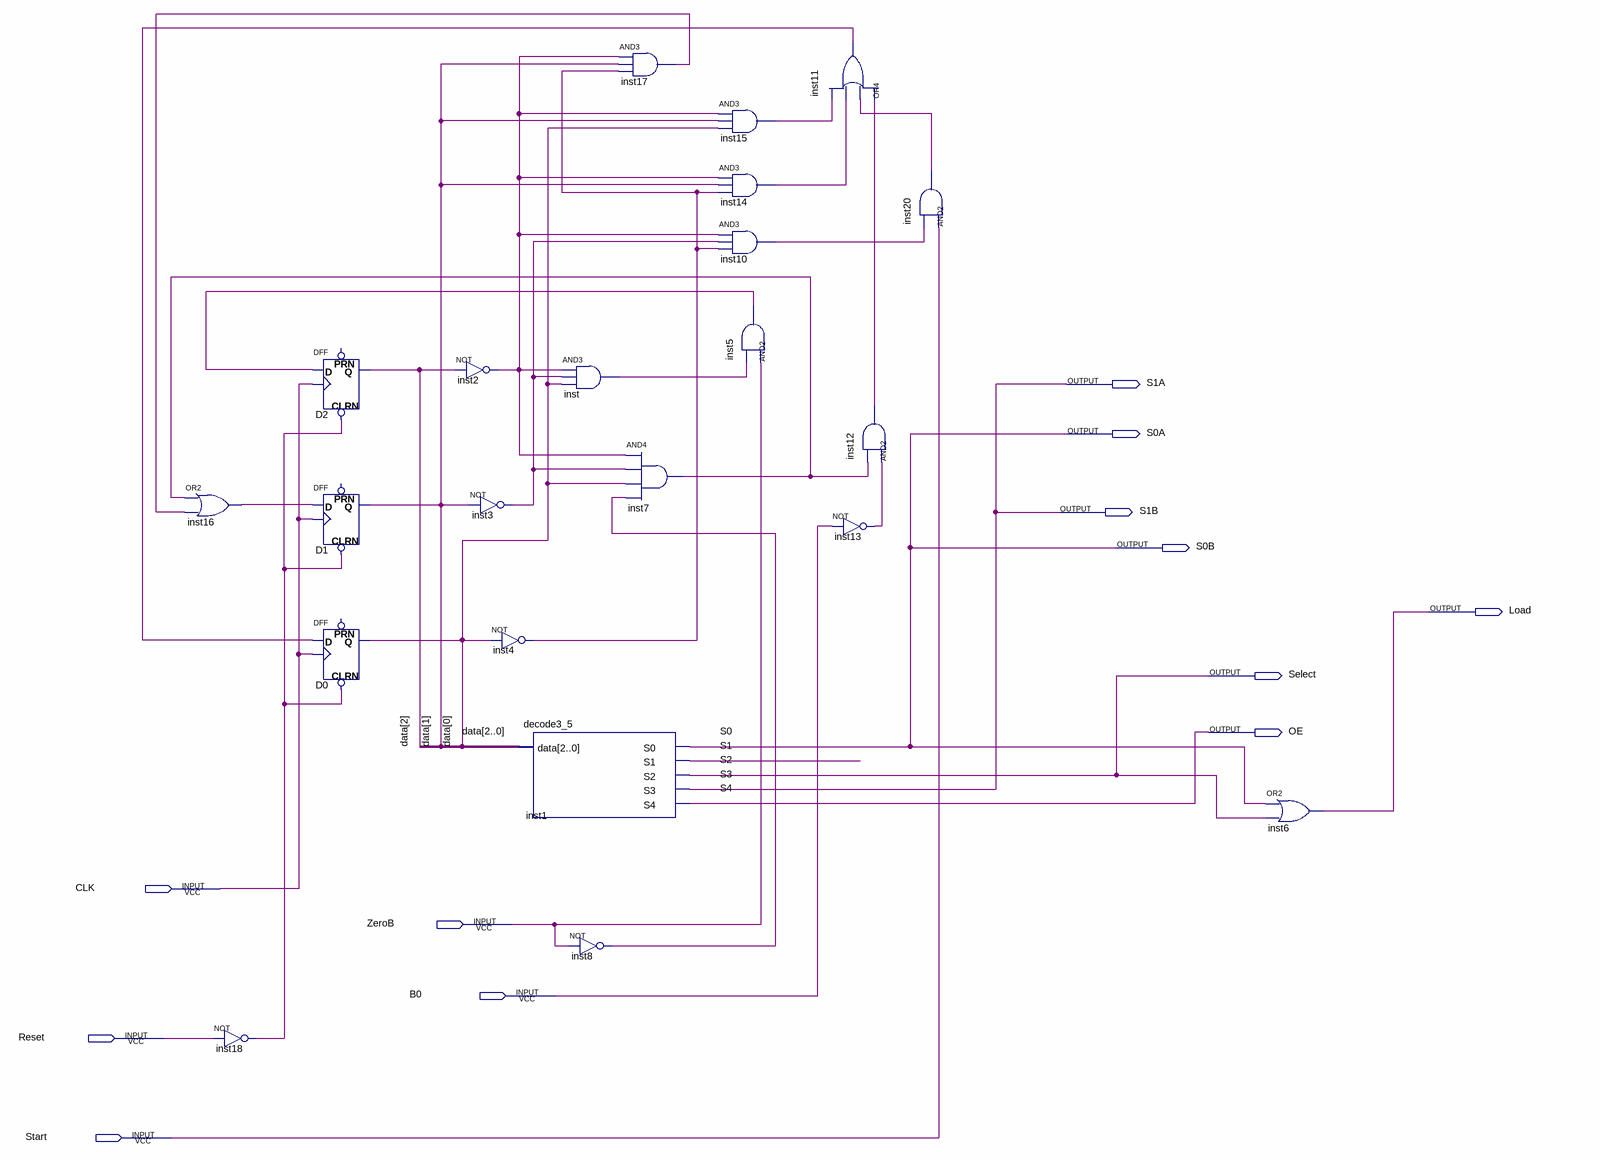
[diagram p0: schematic sheet]
// Quartus schematic Controller_Mul.bdf as structural Verilog: 22 symbols, 12 pins
module Controller_Mul (
  input  CLK,
  input  ZeroB,
  input  B0,
  input  Reset,
  input  Start,
  output S1A,
  output S0A,
  output S1B,
  output S0B,
  output Load,
  output Select,
  output OE
);

  wire inst2_out, inst3_out, inst4_out, inst5_out, inst7_out, inst8_out, inst10_out, inst11_out, inst12_out,
       inst13_out, inst14_out, inst15_out, inst16_out, inst17_out, inst18_out, inst20_out, inst_out, S1;
  wire [2:0] data;

  or inst16 (inst16_out, inst7_out, inst17_out);
  not inst18 (inst18_out, Reset);
  DFF D2 (.CLRN(inst18_out), .CLK(CLK), .D(inst5_out), .Q(data[2]));  // open: PRN
  DFF D1 (.CLRN(inst18_out), .CLK(CLK), .D(inst16_out), .Q(data[1]));  // open: PRN
  DFF D0 (.CLRN(inst18_out), .CLK(CLK), .D(inst11_out), .Q(data[0]));  // open: PRN
  not inst2 (inst2_out, data[2]);
  not inst3 (inst3_out, data[1]);
  not inst4 (inst4_out, data[0]);
  decode3_5 inst1 (.data(data), .S0(S0A), .S1(S1), .S2(Select), .S3(S1A), .S4(OE));
  and inst (inst_out, inst2_out, inst3_out, data[0]);
  not inst8 (inst8_out, ZeroB);
  and inst17 (inst17_out, inst2_out, data[1], inst4_out);
  and inst7 (inst7_out, inst2_out, inst3_out, data[0], inst8_out);
  and inst15 (inst15_out, inst2_out, data[1], data[0]);
  and inst14 (inst14_out, inst2_out, data[1], inst4_out);
  and inst10 (inst10_out, inst2_out, inst3_out, inst4_out);
  and inst5 (inst5_out, ZeroB, inst_out);
  or inst11 (inst11_out, inst12_out, inst20_out, inst14_out, inst15_out);
  and inst12 (inst12_out, inst13_out, inst7_out);
  not inst13 (inst13_out, B0);
  and inst20 (inst20_out, Start, inst10_out);
  or inst6 (Load, S0A, Select);

  assign S0B = S0A;
  assign S1B = S1A;

  // Other names for the same wires on the sheet: S0 = S0A; S3 = S1A; S2 = Select; S4 = OE
endmodule
